# Altium project Science.PrjPcb
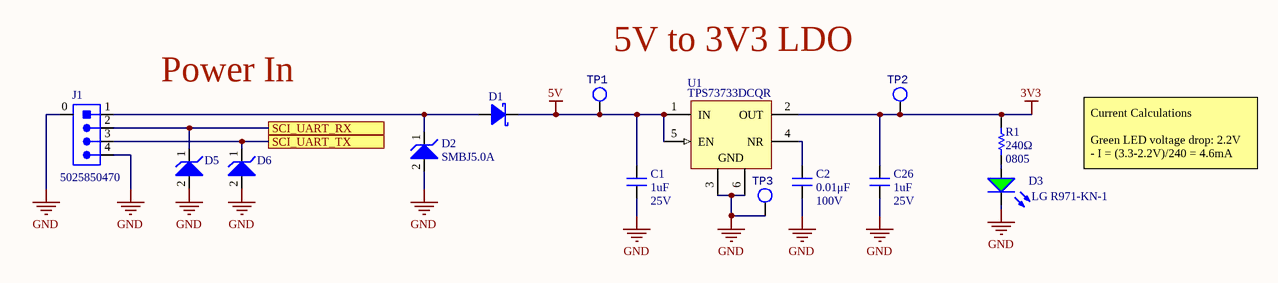
[diagram p0: SH1-POWER.SchDoc]
3 sheets, 91 parts. Net scope: flat (ports and power ports of the same name join across sheets).
Sheets:
  SH1-POWER.SchDoc
  SH2-MCU.SchDoc
  SH3-CONTROLS.SchDoc

## Sheet SH1-POWER.SchDoc: RC Science - Power
size Letter; DrawnBy: Christopher Arjune; SheetNumber: 1; SheetTotal: 3

### Parts
C1  Capacitance: 1uF  Voltage Rating (DC): 25V  [CAPC2012X140N]
C2  value 0.01μF  Voltage Rating: 100V  [CAP2012]  (hidden comment: CAP_0.01uF_100V_0805)
C26  Capacitance: 1uF  Voltage Rating (DC): 25V  [CAPC2012X140N]
D1  DIO_SCHOTTKY_30V_2A  [SOD-128]  (value not drawn)
D2  TVS_DIODE_UNIDIR_5V  [SMBJ5.0A]  (value not drawn)
D3  LG R971-KN-1  [LED_0805_LINE]
D5  TVS_DIODE_UNIDIR_3.3V  [SOD523]  (value not drawn)
D6  TVS_DIODE_UNIDIR_3.3V  [SOD523]  (value not drawn)
J1  Manufactor Number: 5025850470  [MOLEX-5025850470]  (hidden comment: CON_4M_SM_RA)
R1  Resistance: 240Ω  Case Code (Imperial): 0805  [RESC2012X60N]  (hidden comment: 240)
TP1  TESTPOINT_LOOP  [TESTPOINT_LOOP]  (value not drawn)
TP2  TESTPOINT_LOOP  [TESTPOINT_LOOP]  (value not drawn)
TP3  TESTPOINT_LOOP  [TESTPOINT_LOOP]  (value not drawn)
U1  TPS73733DCQR  [SOT-223-6]

### Ports
SCI_UART_RX, SCI_UART_TX

### Nets
3V3: C26.2 R1.2 TP2.1 U1.2(OUT)
5V: C1.1 D1.2(Cathode) TP1.1 U1.1(IN) U1.5(EN)
GND: C1.2 C2.1 C26.1 D2.2 D3.2(K) D5.2 D6.2 J1.0 J1.4 TP3.1 U1.3(GND) U1.6(GND)
NetC2_2: C2.2 U1.4(NR)
NetD1_1: D1.1(Anode) D2.1 J1.1
NetD3_1: D3.1(A) R1.1
NetD5_1: D5.1 J1.2 ; port SCI_UART_RX
NetD6_1: D6.1 J1.3 ; port SCI_UART_TX

### Notes on the sheet
- Power In
- 5V to 3V3 LDO
- Current Calculations
  Green LED voltage drop: 2.2V
  - I = (3.3-2.2V)/240 = 4.6mA
- Title
- Size:
- Date:
- Letter
- Drawn By:
- Sheet
- of
- File:

### Library data of the parts
C1 C26 = CAP_1uF_25V_0805: CAP CER 1UF 25V X7R 0805; Manufacturer 1: Murata; Manufacturer Part Number 1: GCM21BR71E105KA56K; Tolerance: 10%; Supplier 1: Digi-Key; Stock 1: 31473; Pricing 1: 1=0.34000, 10=0.23600, 100=0.13360, 500=0.09432, 1000=0.08254, 2500=0.07861, 5000=0.07271 (USD); RoHS: Yes; Mount: Surface Mount; Case/Package: 0805; Case Code (Metric): 2012; Case Code (Imperial): 0805; Min Operating Temperature: -55°C; Max Operating Temperature: 125°C; Package Quantity: 10000; Voltage Rating: 25V; Packaging: Tape and Reel; Dielectric: X7R; Termination: SMD/SMT; Length: 2mm; Height: 1.25mm; Width: 0.049inch; Thickness: 0.055inch; Depth: 1.25mm; Ratings: AEC-Q200; Radiation Hardening: No; ComponentLink1URL: https://datasheet.ciiva.com/169/product-169236.pdf?src-supplier=Digi-Key; ComponentLink1Description: https://datasheet.ciiva.com/169/product-169236.pdf?src-supplier=Digi-Key; ComponentLink2URL: https://datasheet.ciiva.com/11616/product-11616618.pdf?src-supplier=Avnet; ComponentLink2Description: https://datasheet.ciiva.com/11616/product-11616618.pdf?src-supplier=Avnet; Supplier Part Number 1: 490-14743-1-ND
C2 = CAP_0.01uF_100V_0805: CAP CER 10000PF 100V X7R 0805; Manufacturer 1: KEMET; Manufacturer Part Number 1: C0805C103K1RACTU; Tolerance: 10%; Mount: Surface Mount; Case Code (Metric): 2012; Case Code (Imperial): 0805; Min Operating Temperature: -55°C; Max Operating Temperature: 125°C; Termination: SMD/SMT; Supplier 1: Digi-Key; Supplier Part Number 1: 399-1159-1-ND; Package: 0805 (2012 Metric); Dielectric: X7R
D1 = DIO_SCHOTTKY_30V_2A: DIODE SCHOTTKY 30V 2A PMDTM; Manufacturer 1: Rohm Semiconductor; Manufacturer Part Number 1: RSX205LAM30TR; Vf (Max): 490mV; Supplier 1: Digi-Key; Supplier Part Number 1: RSX205LAM30CT-ND; Mount: Surface Mount; Vr (Max): 30V; Io: 2A
D2 = TVS_DIODE_UNIDIR_5V: TVS DIODE 5V 9.2V DO214AA; Manufacturer 1: Bourns; Operating Supply Voltage: 3.5V; Max Surge Current: 100A; Reverse Breakdown Voltage: 6.4V; Peak Pulse Power: 600W; Power Line Protection: No; Breakdown Voltage: 7.25V; Number of Channels: 1; Polarity: Unidirectional; Max Reverse Leakage Current: 800uA; Test Current: 10mA; Peak Pulse Current: 65.2A; Supplier 1: Digi-Key; Mount: Surface Mount; Number of Pins: 2; Min Operating Temperature: -55°C; Max Operating Temperature: 150°C; Reverse Standoff Voltage: 5V; Clamping Voltage: 9.2V; Max Power Dissipation: 600W; Max Breakdown Voltage: 7.25V; Leakage Current: 800uA; Composition: Zener; Supplier Part Number 1: SMBJ5.0ABCT-ND; Zener Voltage: *; Min Breakdown Voltage: 6.4V; Manufacturer Part Number 1: SMBJ5.0A
D3 = DIO_LED_G: LED GREEN DIFFUSED 0805 SMD; Manufacturer 1: OSRAM; Forward Voltage Drop: 2.2V; Package: 0805 (2012 Metric); Manufacturer Part Number 1: LG R971-KN-1; Supplier Part Number 1: 475-1410-1-ND; Supplier 1: Digi-Key; Mount: Surface Mount
D5 D6 = TVS_DIODE_UNIDIR_3.3V: TVS DIODE 3.3V 14.1V SOD523. Used to protect each connector input line going into the MCU.; Manufacturer 1: ON Semiconductor; Manufacturer Part Number 1: ESD5Z3.3T1G; Reverse Breakdown Voltage: 5V; Peak Pulse Power: 158W; Power Line Protection: No; Number of Channels: 1; Polarity: Unidirectional; Peak Pulse Current: 11.2A; Supplier 1: Digi-Key; Mount: Surface Mount; Number of Pins: 2; Min Operating Temperature: -55°C; Max Operating Temperature: 150°C; Reverse Standoff Voltage: 3.3V; Clamping Voltage: 14.1V; Composition: Zener; Supplier Part Number 1: ESD5Z3.3T1GOSCT-ND
J1 = CON_4M_SM_RA: CONN HEADER SMD RIGHT ANGLE 1.5 MM PITCH; Manufacturer: Molex; Supplier 1: Digi-Key; Supplier Part Number 1: WM9449CT-ND
R1 = RES_120Ω_0805_1%: RES 240 OHM 1% 1/8W 0805; Manufacturer 1: Vishay; Manufacturer Part Number 1: CRCW0805240RFKEA; Temperature Coefficient: 100ppm/°C; Max Power Dissipation: 125mW; Voltage Rating (DC): 150V; Supplier 1: Digi-Key; Stock 1: 27214; Pricing 1: 1=0.10000, 10=0.05700, 100=0.02310, 1000=0.01039, 2500=0.00902 (USD); RoHS: Yes; Case/Package: 0805; Case Code (Metric): 2012; Contact Plating: Tin; Weight: 0.000194oz; Min Operating Temperature: -55°C; Max Operating Temperature: 155°C; Tolerance: 1%; Packaging: Tape and Reel; Package Quantity: 10; Resistor Type: Thick Film; Number of Terminations: 2; Features: Automotive AEC-Q200; Power Rating: 125mW; Voltage Rating: 150V; Termination: SMD/SMT; Length: 2mm; Width: 0.049inch; Height: 0.45mm; Depth: 1.25mm; Radiation Hardening: No; Lead Free: Lead Free; REACH SVHC: Unknown; Military Standard: Not; ComponentLink1URL: https://datasheet.ciiva.com/11810/0900766b80d98b26-11810664.pdf?src-supplier=RSComponents; ComponentLink1Description: https://datasheet.ciiva.com/11810/0900766b80d98b26-11810664.pdf?src-supplier=RSComponents; ComponentLink2URL: https://datasheet.ciiva.com/2467/dcrcwe3-2467397.pdf?src-supplier=Digi-Key; ComponentLink2Description: https://datasheet.ciiva.com/2467/dcrcwe3-2467397.pdf?src-supplier=Digi-Key; ComponentLink3URL: https://datasheet.ciiva.com/5541/dcrcwe3-109170-5541461.pdf?src-supplier=Mouser; ComponentLink3Description: https://datasheet.ciiva.com/5541/dcrcwe3-109170-5541461.pdf?src-supplier=Mouser; ComponentLink4URL: https://datasheet.ciiva.com/2467/dcrcwe3-2467395.pdf?src-supplier=Digi-Key; ComponentLink4Description: https://datasheet.ciiva.com/2467/dcrcwe3-2467395.pdf?src-supplier=Digi-Key; ComponentLink5URL: https://datasheet.ciiva.com/2467/dcrcwe3-2467396.pdf?src-supplier=Digi-Key; ComponentLink5Description: https://datasheet.ciiva.com/2467/dcrcwe3-2467396.pdf?src-supplier=Digi-Key; ComponentLink6URL: https://datasheet.ciiva.com/15159/getdatasheetpartid-101887-15159995.pdf?src-supplier=Verical; ComponentLink6Description: https://datasheet.ciiva.com/15159/getdatasheetpartid-101887-15159995.pdf?src-supplier=Verical; ComponentLink7URL: https://datasheet.ciiva.com/16435/dcrcwe3-16435931.pdf?src-supplier=Future+Electronics; ComponentLink7Description: https://datasheet.ciiva.com/16435/dcrcwe3-16435931.pdf?src-supplier=Future+Electronics; ComponentLink8URL: https://datasheet.ciiva.com/26317/fld-crcw-e3-data-en-26317341.pdf?src-supplier=Distrelec; ComponentLink8Description: https://datasheet.ciiva.com/26317/fld-crcw-e3-data-en-26317341.pdf?src-supplier=Distrelec; Supplier Part Number 1: 541-240CCT-ND
TP1-TP3 = TESTPOINT_LOOP: Loop testpoint through-hole pad; Manufacturer 1: Keystone Electronics; Manufacturer Part Number 1: 5002; Supplier Part Number 1: 36-5002-ND; Supplier 1: Digi-Key; Mount: Through Hole
U1 = CMP-0395-00300-2: IC REG LINEAR 3.3V 1A SOT223-6; Manufacturer: Texas Instruments; Fixed Output Options(V): 3.3; Vdo(Typ)(mV): 130; Iout(Max)(A): 1; Accuracy(%): 3; SubFamily: Single Channel LDO; Eco-Plan: Green (RoHS & no Sb/Br); Vin(Min)(V): 2.2; Vin(Max)(V): 5.5; Rating: Catalog; Iq(Typ)(mA): 0.3; PartNumber: TPS73733DCQR; DatasheetVersion: SBVS067O; PackageReference: DCQ0006A; PackageDescription: 6-Pin Plastic Small Outline, Body 3.5 x 6.5 mm, Pitch 1.27 mm; PackageVersion: 4202109/D; Vout Adj(Min)(V): 3.3; Vout Adj(Max)(V): 3.3; Mounting Technology: Surface Mount; Supplier 1: Digi-Key; Supplier Part Number 1: 296-22681-2-ND; Manufacturer 1: Texas Instruments; Manufacturer Part Number 1: TPS73733DCQR

## Sheet SH2-MCU.SchDoc: RC Science - Microcontroller
size Letter; DrawnBy: Christopher Arjune; SheetNumber: 2; SheetTotal: 3
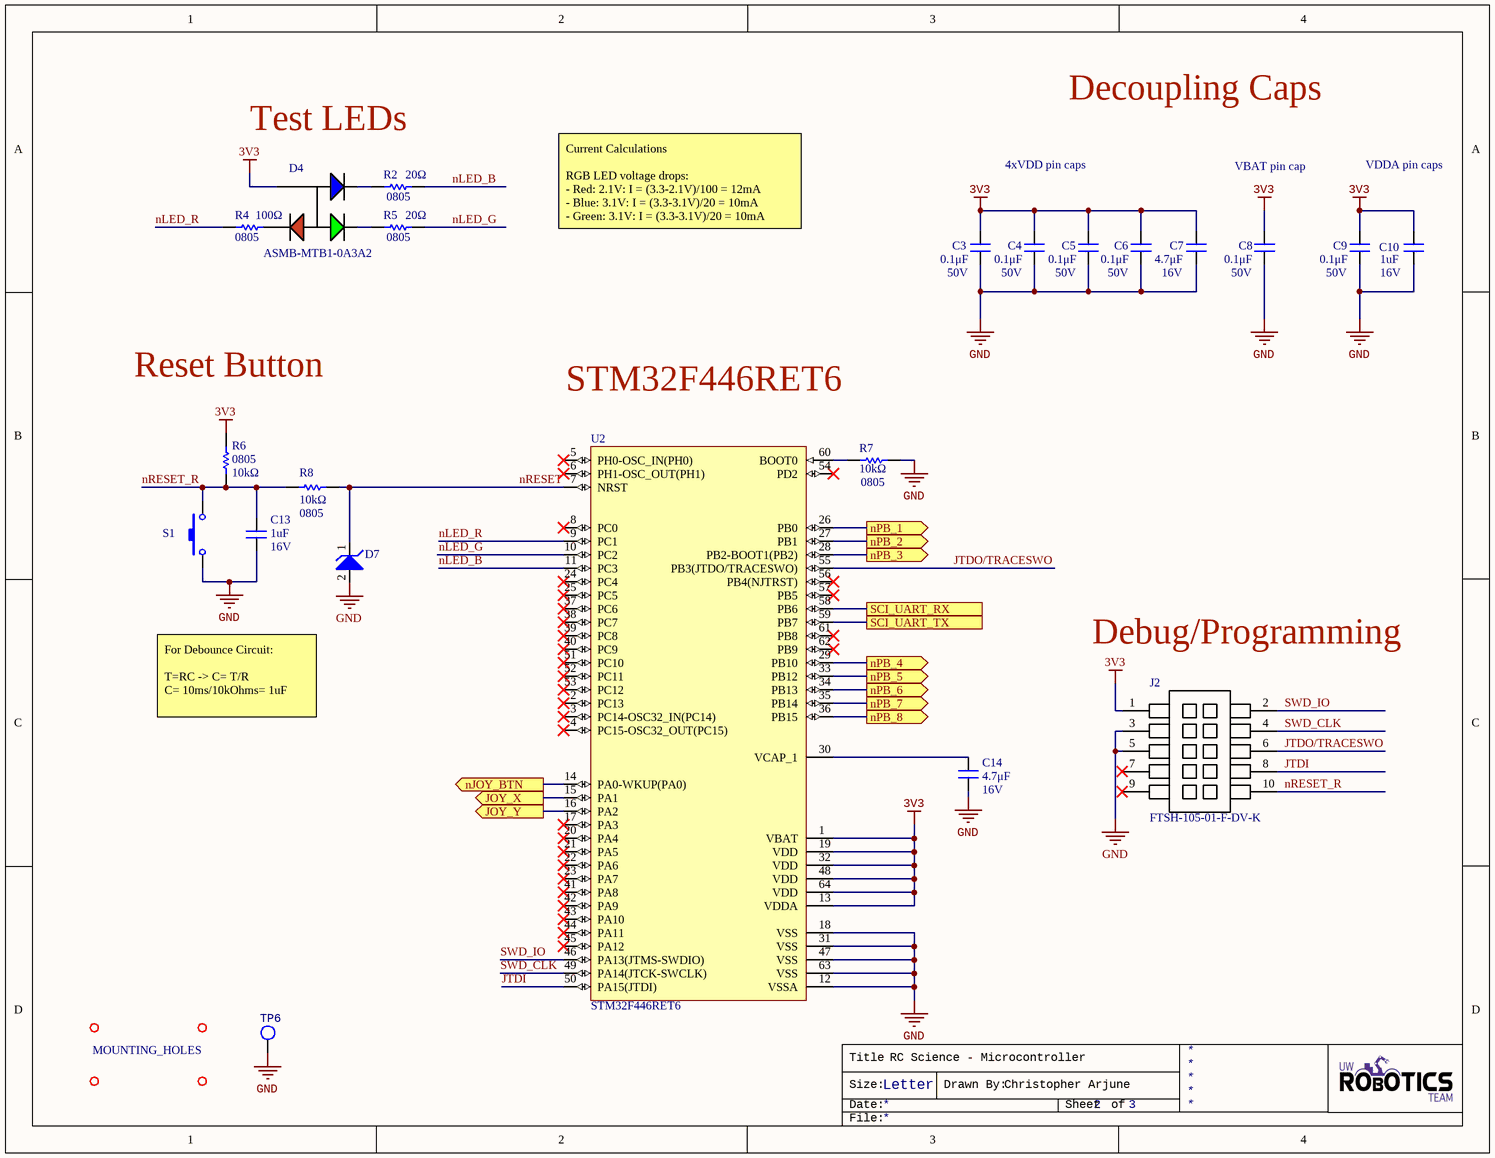
[diagram p1: SH2-MCU.SchDoc]

### Parts
C3  Voltage Rating: 50V  [CAPC2012X140N]  (hidden comment: 0.1μF)
C4  Voltage Rating: 50V  [CAPC2012X140N]  (hidden comment: 0.1μF)
C5  Voltage Rating: 50V  [CAPC2012X140N]  (hidden comment: 0.1μF)
C6  Voltage Rating: 50V  [CAPC2012X140N]  (hidden comment: 0.1μF)
C7  value 4.7μF  Voltage Rating: 16V  [CAPC2012X140N]  (hidden comment: CAP_4.7uF_16V_0805)
C8  Voltage Rating: 50V  [CAPC2012X140N]  (hidden comment: 0.1μF)
C9  Voltage Rating: 50V  [CAPC2012X140N]  (hidden comment: 0.1μF)
C10  value 1uF  Voltage Rating: 16V  [CAPC2012X140N]  (hidden comment: CAP_1uF_16V_0805)
C13  value 1uF  Voltage Rating: 16V  [CAPC2012X140N]  (hidden comment: CAP_1uF_16V_0805)
C14  value 4.7μF  Voltage Rating: 16V  [CAPC2012X140N]  (hidden comment: CAP_4.7uF_16V_0805)
D4  Manufacturer Part Number 1: ASMB-MTB1-0A3A2  [LED_RGB]  (hidden comment: LED_RGB)
D7  TVS_DIODE_UNIDIR_3.3V  [SOD523]  (value not drawn)
J2  Manufacturer Part Number 1: FTSH-105-01-F-DV-K  [FTSH-105-01-F-DV-K-P-TR]  (hidden comment: CON_PROGRAMMING)
MH1  MOUNTING_HOLES  [MOUNTING_HOLE]  (value not drawn)
MH2  MOUNTING_HOLES  [MOUNTING_HOLE]  (value not drawn)
MH3  MOUNTING_HOLES  [MOUNTING_HOLE]
MH4  MOUNTING_HOLES  [MOUNTING_HOLE]  (value not drawn)
R2  value 20Ω  Case Code (Imperial): 0805  [RESC2012X60N]  (hidden comment: RES_20Ω_0805)
R4  value 100Ω  Case Code (Imperial): 0805  [RESC2012X60N]  (hidden comment: RES_100Ω_0805)
R5  value 20Ω  Case Code (Imperial): 0805  [RESC2012X60N]  (hidden comment: RES_20Ω_0805)
R6  value 10kΩ  Case Code (Imperial): 0805  [RESC2012X60N]  (hidden comment: RES_10kΩ_0805)
R7  value 10kΩ  Case Code (Imperial): 0805  [RESC2012X60N]  (hidden comment: RES_10kΩ_0805)
R8  value 10kΩ  Case Code (Imperial): 0805  [RESC2012X60N]  (hidden comment: RES_10kΩ_0805)
S1  SW_TACTILE  [B3U-1000P]  (value not drawn)
TP6  TESTPOINT_LOOP  [TESTPOINT_LOOP]  (value not drawn)
U2  STM32F446RET6  [STM-LQFP64_L]

### Ports
JOY_X (out), JOY_Y (out), nJOY_BTN (out), nPB_1 (out), nPB_2 (out), nPB_3 (out), nPB_4 (out), nPB_5 (out), nPB_6 (out), nPB_7 (out), nPB_8 (out), SCI_UART_RX, SCI_UART_TX

### Nets
3V3: C3.2 C4.2 C5.2 C6.2 C7.2 C8.2 C9.2 C10.2 D4.4 J2.1 R6.2 U2.1(VBAT) U2.13(VDDA) U2.19(VDD) U2.32(VDD) U2.48(VDD) U2.64(VDD)
GND: C3.1 C4.1 C5.1 C6.1 C7.1 C8.1 C9.1 C10.1 C13.1 C14.1 D7.2 J2.3 J2.5 R7.2 S1.2 TP6.1 U2.12(VSSA) U2.18(VSS) U2.31(VSS) U2.47(VSS) U2.63(VSS)
JTDI: J2.8 U2.50(PA15(JTDI))
JTDO/TRACESWO: J2.6 U2.55(PB3(JTDO/TRACESWO))
nLED_B: R2.2 U2.11(PC3)
nLED_G: R5.2 U2.10(PC2)
nLED_R: R4.1 U2.9(PC1)
nRESET: D7.1 R8.2 U2.7(NRST)
nRESET_R: C13.2 J2.10 R6.1 R8.1 S1.1
SWD_CLK: J2.4 U2.49(PA14(JTCK-SWCLK))
SWD_IO: J2.2 U2.46(PA13(JTMS-SWDIO))
NetC11_2: U2.26(PB0) ; port nPB_1
NetC12_2: U2.33(PB12) ; port nPB_5
NetC14_2: C14.2 U2.30(VCAP_1)
NetC15_2: U2.14(PA0-WKUP(PA0)) ; port nJOY_BTN
NetC16_2: U2.15(PA1) ; port JOY_X
NetC17_2: U2.16(PA2) ; port JOY_Y
NetC18_2: U2.27(PB1) ; port nPB_2
NetC19_2: U2.34(PB13) ; port nPB_6
NetC20_2: U2.28(PB2-BOOT1(PB2)) ; port nPB_3
NetC21_2: U2.35(PB14) ; port nPB_7
NetC22_2: U2.29(PB10) ; port nPB_4
NetC23_2: U2.36(PB15) ; port nPB_8
NetD4_1: D4.1 R4.2
NetD4_2: D4.2 R5.1
NetD4_3: D4.3 R2.1
NetD5_1: U2.58(PB6) ; port SCI_UART_RX
NetD6_1: U2.59(PB7) ; port SCI_UART_TX
NetR7_1: R7.1 U2.60(BOOT0)

Not connected (* = marked no-connect by the designer): J2 7* 9*; U2 2(PC13)* 3(PC14-OSC32_IN(PC14))* 4(PC15-OSC32_OUT(PC15))* 5(PH0-OSC_IN(PH0))* 6(PH1-OSC_OUT(PH1))* 8(PC0)* 17(PA3)* 20(PA4)* 21(PA5)* 22(PA6)* 23(PA7)* 24(PC4)* 25(PC5)* 37(PC6)* 38(PC7)* 39(PC8)* 40(PC9)* 41(PA8)* 42(PA9)* 43(PA10)* 44(PA11)* 45(PA12)* 51(PC10)* 52(PC11)* 53(PC12)* 54(PD2)* 56(PB4(NJTRST))* 57(PB5)* 61(PB8)* 62(PB9)*

### Notes on the sheet
- Test LEDs
- 4xVDD pin caps
- Decoupling Caps
- VDDA pin caps
- Current Calculations
  RGB LED voltage drops:
  - Red: 2.1V: I = (3.3-2.1V)/100 = 12mA
  - Blue: 3.1V: I = (3.3-3.1V)/20 = 10mA
  - Green: 3.1V: I = (3.3-3.1V)/20 = 10mA
- VBAT pin cap
- Reset Button
- STM32F446RET6
- Debug/Programming
- For Debounce Circuit:
  T=RC -> C= T/R
  C= 10ms/10kOhms= 1uF
- Title
- Size:
- Date:
- Letter
- Drawn By:
- Sheet
- of
- File:

### Library data of the parts
C3-C6 C8 C9 = CAP_0.1uF_50V_0805: CAP CER 0.1UF 50V X7R 0805; Manufacturer 1: Murata Electronics; Manufacturer Part Number 1: GCD21BR71H104KA01L; Tolerance: 10%; Mount: Surface Mount; Case Code (Metric): 2012; Case Code (Imperial): 0805; Min Operating Temperature: -55°C; Max Operating Temperature: 125°C; Dielectric: X7R; Termination: SMD/SMT; Length: 2mm; Height: 1.25mm; Width: 0.049inch; Thickness: 0.049inch; Depth: 1.25mm; Ratings: AEC-Q200; ComponentLink1URL: https://datasheet.ciiva.com/29537/c03e-29537701.pdf?src-supplier=Digi-Key; ComponentLink1Description: https://datasheet.ciiva.com/29537/c03e-29537701.pdf?src-supplier=Digi-Key; Supplier 1: Digi-Key; Supplier Part Number 1: 490-11955-1-ND; Value: 0.1μF; Package: 0805 (2012 Metric)
C7 C14 = CAP_4.7uF_16V_0805: CAP CER 4.7UF 16V X5R 0805; Manufacturer 1: Samsung Electro-Mechanics; Manufacturer Part Number 1: CL21A475KOFNNNE; Tolerance: 10%; Mount: Surface Mount; Case Code (Metric): 2012; Case Code (Imperial): 0805; Min Operating Temperature: -55°C; Max Operating Temperature: 85°C; Dielectric: X5R; Termination: SMD/SMT; Supplier 1: Digi-Key; Supplier Part Number 1: 1276-1065-1-ND; Package: 0805 (2012 Metric)
C10 C13 = CAP_1uF_16V_0805: CAP CER 1UF 16V X7R 0805; Manufacturer 1: Yageo; Manufacturer Part Number 1: CC0805KKX7R7BB105; Tolerance: 10%; Mount: Surface Mount; Case Code (Metric): 2012; Case Code (Imperial): 0805; Min Operating Temperature: -55°C; Max Operating Temperature: 125°C; Dielectric: X7R; Termination: SMD/SMT; Supplier 1: Digi-Key; Supplier Part Number 1: 311-1365-1-ND; Package: 0805 (2012 Metric)
D4 = LED_RGB: LED RGB DIFFUSED 4PLCC SMD; Manufacturer 1: Broadcom; Color: Blue,Green,Red; Lens Color: White; Viewing Angle: 115°; Lens Style: Round; Luminous Intensity: 350mcd; Dominant Wavelength: 470nm; Forward Voltage: 3.1V; Test Current: 20mA; Supplier 1: Digi-Key; Stock 1: 142531; Pricing 1: 1=0.60000, 10=0.47100, 100=0.30210, 500=0.25980, 1000=0.20059 (USD); RoHS: Yes; Mount: Surface Mount; Case/Package: PLCC; Number of Pins: 4; Packaging: Cut Tape; Lens Transparency: Diffused; Length: 3.2mm; Height: 1.9mm; Width: 2.8mm; REACH SVHC: No SVHC; ComponentLink1URL: http://www.farnell.com/datasheets/2111106.pdf?src-supplier=Farnell; ComponentLink1Description: http://www.farnell.com/datasheets/2111106.pdf?src-supplier=Farnell; ComponentLink2URL: https://docs.broadcom.com/docs/AV02-4194EN?src-supplier=Digi-Key; ComponentLink2Description: https://docs.broadcom.com/docs/AV02-4194EN?src-supplier=Digi-Key; ComponentLink3URL: http://www.farnell.com/datasheets/1801564.pdf?src-supplier=Element14; ComponentLink3Description: http://www.farnell.com/datasheets/1801564.pdf?src-supplier=Element14; ComponentLink4URL: http://www.farnell.com/datasheets/2111106.pdf?src-supplier=Newark; ComponentLink4Description: http://www.farnell.com/datasheets/2111106.pdf?src-supplier=Newark; Supplier Part Number 1: 516-3280-1-ND
D7 = TVS_DIODE_UNIDIR_3.3V: as D5 on sheet SH1-POWER; Supplier 1: Digi-Key; Mount: Surface Mount; Number of Pins: 2; Min Operating Temperature: -55°C; Max Operating Temperature: 150°C; Reverse Standoff Voltage: 3.3V; Clamping Voltage: 14.1V; Composition: Zener; Supplier Part Number 1: ESD5Z3.3T1GOSCT-ND
J2 = CON_PROGRAMMING: Board Connector, 10 Contact(s), 2 Row(s), Male, Straight, 0.05 inch Pitch, Surface Mount Terminal, Locking; Manufacturer 1: Samtec; Number of Contacts: 10; Connector Type: Male Pin; Max Current Rating: 1.75A; Pitch: 1.27mm; Supplier 1: Digi-Key; RoHS: Yes; Category: Headers and Wire Housings; Stock 1: 19926; Pricing 1: 1=2.90000, 10=2.78400, 100=2.32000, 500=1.97200, 1000=1.68200, 5000=1.50800 (USD); Mount: Surface Mount; Contact Plating: Gold; Contact Material: Copper,Bronze; Housing Color: Black; Housing Material: Polymer; Color: Black; Min Operating Temperature: -55°C; Max Operating Temperature: 125°C; Number of Rows: 2; Termination: Solder; Packaging: Rail/Tube; Orientation: Straight; Package Quantity: 1; Number of Positions: 10; Length: 15.2mm; Height: 3.3mm; Depth: 3.43mm; Row Spacing: 0.05inch; Contact Mating Length: 0.12inch; Radiation Hardening: No; Lead Free: Lead Free; ComponentLink1URL: https://datasheet.ciiva.com:443/pdfs/VipMasterIC/IC/SAMI/SAMI-S-A0003531380/SAMI-S-A0003531380-1.pdf?src-supplier=IHS+Markit; ComponentLink1Description: https://datasheet.ciiva.com:443/pdfs/VipMasterIC/IC/SAMI/SAMI-S-A0003531380/SAMI-S-A0003531380-1.pdf?src-supplier=IHS+Markit; ComponentLink2URL: https://datasheet.ciiva.com/19461/2046846-19461026.pdf?src-supplier=Jameco; ComponentLink2Description: https://datasheet.ciiva.com/19461/2046846-19461026.pdf?src-supplier=Jameco; ComponentLink3URL: https://datasheet.ciiva.com/16657/ftsh-mt-16657371.pdf?src-supplier=Avnet+Europe; ComponentLink3Description: https://datasheet.ciiva.com/16657/ftsh-mt-16657371.pdf?src-supplier=Avnet+Europe; ComponentLink4URL: https://datasheet.ciiva.com/15195/getdatasheetpartid-133463-15195260.pdf?src-supplier=Verical; ComponentLink4Description: https://datasheet.ciiva.com/15195/getdatasheetpartid-133463-15195260.pdf?src-supplier=Verical; ComponentLink5URL: https://datasheet.ciiva.com/738/ftsh-1xx-xx-xxx-dv-xxx-mkt-738998.pdf?src-supplier=Digi-Key; ComponentLink5Description: https://datasheet.ciiva.com/738/ftsh-1xx-xx-xxx-dv-xxx-mkt-738998.pdf?src-supplier=Digi-Key; ComponentLink6URL: https://datasheet.ciiva.com/10245/ftsh-mt-10245273.pdf?src-supplier=Avnet; ComponentLink6Description: https://datasheet.ciiva.com/10245/ftsh-mt-10245273.pdf?src-supplier=Avnet; Supplier Part Number 1: SAM8796-ND
MH1-MH4 = MOUNTING_HOLES: 6cm x 6cm
R2 R5 = RES_20Ω_0805: RES SMD 20 OHM 1% 1/8W 0805; Manufacturer 1: Yageo; Manufacturer Part Number 1: RC0805FR-0720RL; Resistance: 20; Power Rating: 125mW; Supplier 1: Digi-Key; Case Code (Metric): 2012; Min Operating Temperature: -55°C; Max Operating Temperature: 155°C; Tolerance: 1%; Termination: SMD/SMT; Supplier Part Number 1: 311-20.0CRCT-ND; Package: 0805 (2012 Metric)
R4 = RES_100Ω_0805: RES SMD 100 OHM 1% 1/8W 0805; Manufacturer 1: Yageo; Manufacturer Part Number 1: RC0805FR-07100RL; Power Rating: 125mW; Supplier 1: Digi-Key; Mount: Surface Mount; Case Code (Metric): 2012; Supplier Part Number 1: 311-100CRCT-ND; Package: 0805 (2012 Metric)
R6-R8 = RES_10kΩ_0805: RES SMD 10K OHM 1% 1/8W 0805; Manufacturer 1: Yageo; Manufacturer Part Number 1: RC0805FR-0710KL; Power Rating: 125mW; Supplier 1: Digi-Key; Case Code (Metric): 2012; Min Operating Temperature: -55°C; Max Operating Temperature: 155°C; Resistance: 10K; Tolerance: 1%; Termination: SMD/SMT; Supplier Part Number 1: 311-10.0KCRCT-ND; Package: 0805 (2012 Metric)
S1 = SW_TACTILE: Tactile Switch (Grey); Manufacturer 1: Omron Electronics Inc-EMC Div; Manufacturer Part Number 1: B3U-1000P; Supplier 1: Digi-Key; Supplier Part Number 1: SW1020CT-ND; Mount: Surface Mount
TP6 = TESTPOINT_LOOP: Loop testpoint through-hole pad; Manufacturer Part Number 1: 5002; Manufacturer 1: Keystone Electronics; Supplier Part Number 1: 36-5002-ND; Supplier 1: Digi-Key; Mount: Through Hole
U2 = MCU_STM32F446RET6: ARM Cortex-M4 32-bit MCU+FPU, 512 KB Flash, 128 KB Internal RAM, 50 I/Os, 64-Pin LQFP, -40 to 85 degC, Tray; I/Os (High Current): 50; Supply Voltage(Vcc) min (V): 1.7; Operating Frequency(F) (Processor speed) (MHz): 180; D/A Converter: 2; Internal RAM Size (kB): 128; FLASH Size (Prog) (kB): 512; Core: ARM Cortex-M4; ComponentLink1Description: Manufacturer URL; Package Reference: 64-Pin Low-profile Quad Flat Package, Body 10 x 10 mm, Pitch 0.5 mm; ComponentLink2URL: http://www.st.com/st-web-ui/static/active/en/resource/technical/document/datasheet/DM00141306.pdf; Packing: Tray; DatasheetVersion: Rev. 6; ComponentLink1URL: http://www.st.com/; ComponentLink2Description: Datasheet; Package Description: LQFP64; Mounting Technology: Surface Mount; Supplier Part Number 1: 497-15376-ND; Supplier 1: Digi-Key

## Sheet SH3-CONTROLS.SchDoc: RC Science - Controls
size Letter; DrawnBy: Christopher Arjune; SheetNumber: 3; SheetTotal: 3
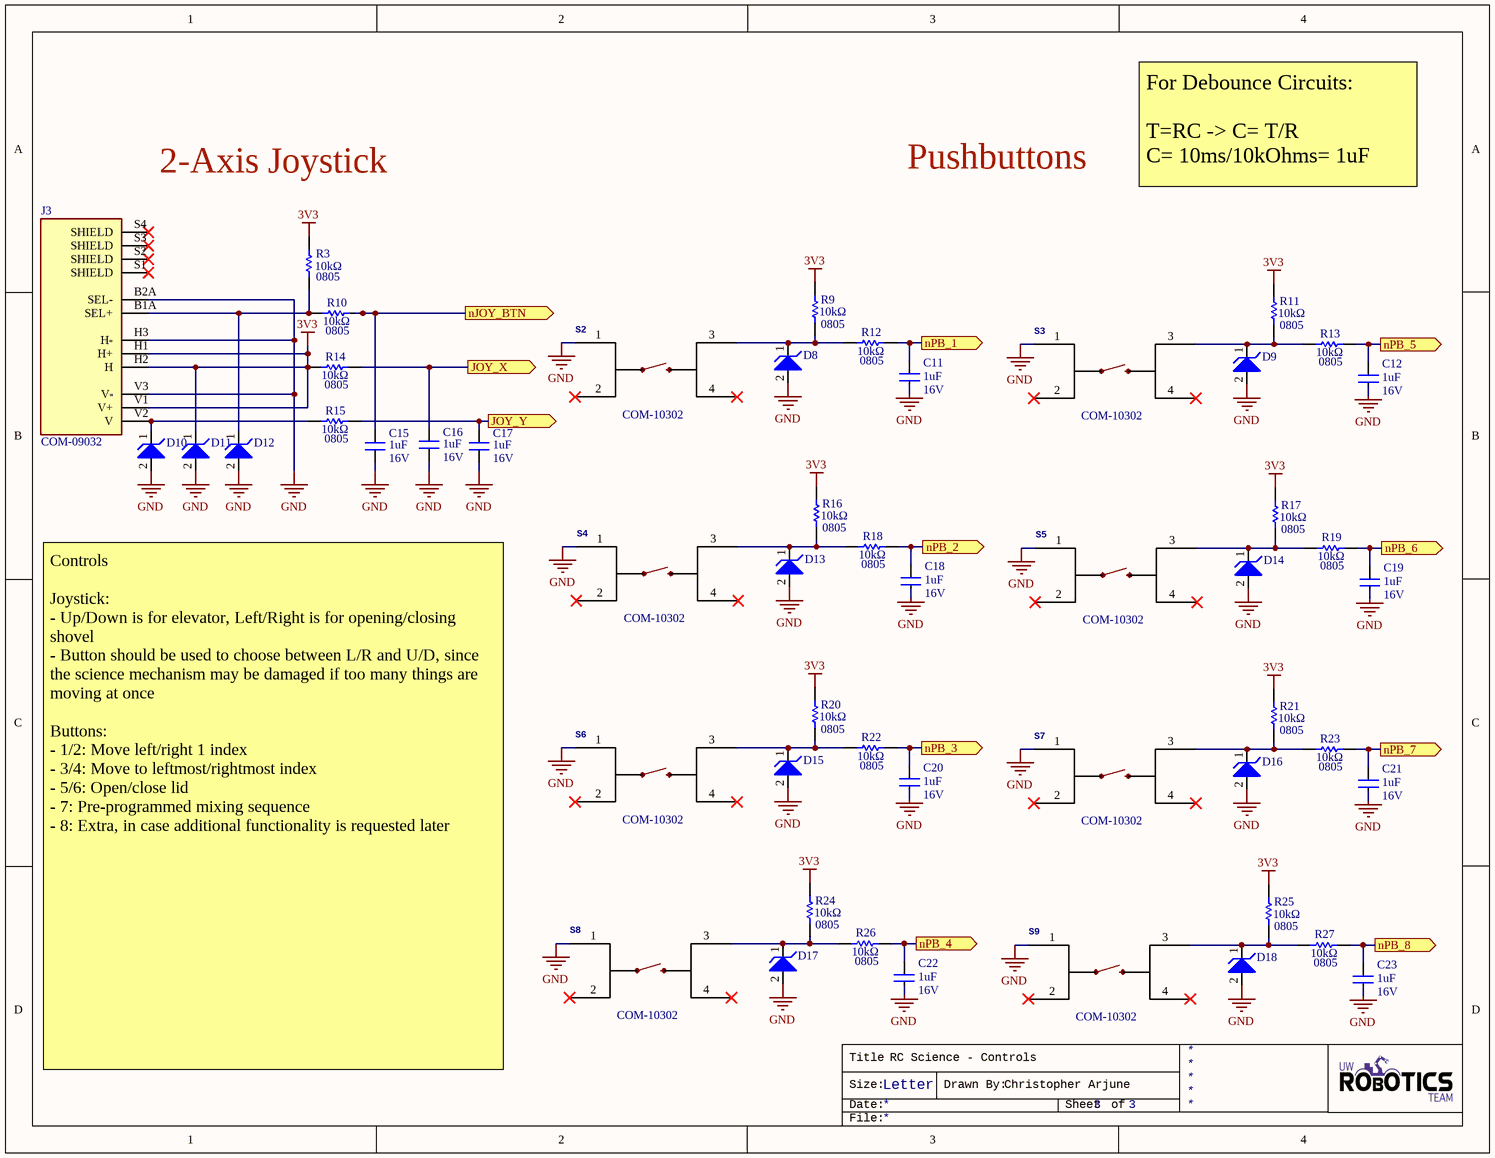
[diagram p2: SH3-CONTROLS.SchDoc]

### Parts
C11  value 1uF  Voltage Rating: 16V  [CAPC2012X140N]  (hidden comment: CAP_1uF_16V_0805)
C12  value 1uF  Voltage Rating: 16V  [CAPC2012X140N]  (hidden comment: CAP_1uF_16V_0805)
C15  value 1uF  Voltage Rating: 16V  [CAPC2012X140N]  (hidden comment: CAP_1uF_16V_0805)
C16  value 1uF  Voltage Rating: 16V  [CAPC2012X140N]  (hidden comment: CAP_1uF_16V_0805)
C17  value 1uF  Voltage Rating: 16V  [CAPC2012X140N]  (hidden comment: CAP_1uF_16V_0805)
C18  value 1uF  Voltage Rating: 16V  [CAPC2012X140N]  (hidden comment: CAP_1uF_16V_0805)
C19  value 1uF  Voltage Rating: 16V  [CAPC2012X140N]  (hidden comment: CAP_1uF_16V_0805)
C20  value 1uF  Voltage Rating: 16V  [CAPC2012X140N]  (hidden comment: CAP_1uF_16V_0805)
C21  value 1uF  Voltage Rating: 16V  [CAPC2012X140N]  (hidden comment: CAP_1uF_16V_0805)
C22  value 1uF  Voltage Rating: 16V  [CAPC2012X140N]  (hidden comment: CAP_1uF_16V_0805)
C23  value 1uF  Voltage Rating: 16V  [CAPC2012X140N]  (hidden comment: CAP_1uF_16V_0805)
D8  TVS_DIODE_UNIDIR_3.3V  [SOD523]  (value not drawn)
D9  TVS_DIODE_UNIDIR_3.3V  [SOD523]  (value not drawn)
D10  TVS_DIODE_UNIDIR_3.3V  [SOD523]  (value not drawn)
D11  TVS_DIODE_UNIDIR_3.3V  [SOD523]  (value not drawn)
D12  TVS_DIODE_UNIDIR_3.3V  [SOD523]  (value not drawn)
D13  TVS_DIODE_UNIDIR_3.3V  [SOD523]  (value not drawn)
D14  TVS_DIODE_UNIDIR_3.3V  [SOD523]  (value not drawn)
D15  TVS_DIODE_UNIDIR_3.3V  [SOD523]  (value not drawn)
D16  TVS_DIODE_UNIDIR_3.3V  [SOD523]  (value not drawn)
D17  TVS_DIODE_UNIDIR_3.3V  [SOD523]  (value not drawn)
D18  TVS_DIODE_UNIDIR_3.3V  [SOD523]  (value not drawn)
J3  Manufacturer Part Number 1: COM-09032  [2_AXIS_JOY]  (hidden comment: 2_AXIS_JOYSTICK)
R3  value 10kΩ  Case Code (Imperial): 0805  [RESC2012X60N]  (hidden comment: RES_10kΩ_0805)
R9  value 10kΩ  Case Code (Imperial): 0805  [RESC2012X60N]  (hidden comment: RES_10kΩ_0805)
R10  value 10kΩ  Case Code (Imperial): 0805  [RESC2012X60N]  (hidden comment: RES_10kΩ_0805)
R11  value 10kΩ  Case Code (Imperial): 0805  [RESC2012X60N]  (hidden comment: RES_10kΩ_0805)
R12  value 10kΩ  Case Code (Imperial): 0805  [RESC2012X60N]  (hidden comment: RES_10kΩ_0805)
R13  value 10kΩ  Case Code (Imperial): 0805  [RESC2012X60N]  (hidden comment: RES_10kΩ_0805)
R14  value 10kΩ  Case Code (Imperial): 0805  [RESC2012X60N]  (hidden comment: RES_10kΩ_0805)
R15  value 10kΩ  Case Code (Imperial): 0805  [RESC2012X60N]  (hidden comment: RES_10kΩ_0805)
R16  value 10kΩ  Case Code (Imperial): 0805  [RESC2012X60N]  (hidden comment: RES_10kΩ_0805)
R17  value 10kΩ  Case Code (Imperial): 0805  [RESC2012X60N]  (hidden comment: RES_10kΩ_0805)
R18  value 10kΩ  Case Code (Imperial): 0805  [RESC2012X60N]  (hidden comment: RES_10kΩ_0805)
R19  value 10kΩ  Case Code (Imperial): 0805  [RESC2012X60N]  (hidden comment: RES_10kΩ_0805)
R20  value 10kΩ  Case Code (Imperial): 0805  [RESC2012X60N]  (hidden comment: RES_10kΩ_0805)
R21  value 10kΩ  Case Code (Imperial): 0805  [RESC2012X60N]  (hidden comment: RES_10kΩ_0805)
R22  value 10kΩ  Case Code (Imperial): 0805  [RESC2012X60N]  (hidden comment: RES_10kΩ_0805)
R23  value 10kΩ  Case Code (Imperial): 0805  [RESC2012X60N]  (hidden comment: RES_10kΩ_0805)
R24  value 10kΩ  Case Code (Imperial): 0805  [RESC2012X60N]  (hidden comment: RES_10kΩ_0805)
R25  value 10kΩ  Case Code (Imperial): 0805  [RESC2012X60N]  (hidden comment: RES_10kΩ_0805)
R26  value 10kΩ  Case Code (Imperial): 0805  [RESC2012X60N]  (hidden comment: RES_10kΩ_0805)
R27  value 10kΩ  Case Code (Imperial): 0805  [RESC2012X60N]  (hidden comment: RES_10kΩ_0805)
S2  Manufacturer Part Number 1: COM-10302  [TACTILE_SWITCH_PTH_12MM]  (hidden comment: Pushbutton)
S3  Manufacturer Part Number 1: COM-10302  [TACTILE_SWITCH_PTH_12MM]  (hidden comment: Pushbutton)
S4  Manufacturer Part Number 1: COM-10302  [TACTILE_SWITCH_PTH_12MM]  (hidden comment: Pushbutton)
S5  Manufacturer Part Number 1: COM-10302  [TACTILE_SWITCH_PTH_12MM]  (hidden comment: Pushbutton)
S6  Manufacturer Part Number 1: COM-10302  [TACTILE_SWITCH_PTH_12MM]  (hidden comment: Pushbutton)
S7  Manufacturer Part Number 1: COM-10302  [TACTILE_SWITCH_PTH_12MM]  (hidden comment: Pushbutton)
S8  Manufacturer Part Number 1: COM-10302  [TACTILE_SWITCH_PTH_12MM]  (hidden comment: Pushbutton)
S9  Manufacturer Part Number 1: COM-10302  [TACTILE_SWITCH_PTH_12MM]  (hidden comment: Pushbutton)

### Ports
JOY_X (out), JOY_Y (out), nJOY_BTN (out), nPB_1 (out), nPB_2 (out), nPB_3 (out), nPB_4 (out), nPB_5 (out), nPB_6 (out), nPB_7 (out), nPB_8 (out)

### Nets
3V3: D11.1 J3.H1(H+) J3.H2(H) J3.V1(V+) R3.1 R9.1 R11.1 R14.1 R16.1 R17.1 R20.1 R21.1 R24.1 R25.1
GND: C11.1 C12.1 C15.1 C16.1 C17.1 C18.1 C19.1 C20.1 C21.1 C22.1 C23.1 D8.2 D9.2 D10.2 D11.2 D12.2 D13.2 D14.2 D15.2 D16.2 D17.2 D18.2 J3.B2A(SEL-) J3.H3(H-) J3.V3(V-) S2.1 S3.1 S4.1 S5.1 S6.1 S7.1 S8.1 S9.1
NetC11_2: C11.2 R12.2 ; port nPB_1
NetC12_2: C12.2 R13.2 ; port nPB_5
NetC15_2: C15.2 R10.2 ; port nJOY_BTN
NetC16_2: C16.2 R14.2 ; port JOY_X
NetC17_2: C17.2 R15.2 ; port JOY_Y
NetC18_2: C18.2 R18.2 ; port nPB_2
NetC19_2: C19.2 R19.2 ; port nPB_6
NetC20_2: C20.2 R22.2 ; port nPB_3
NetC21_2: C21.2 R23.2 ; port nPB_7
NetC22_2: C22.2 R26.2 ; port nPB_4
NetC23_2: C23.2 R27.2 ; port nPB_8
NetD8_1: D8.1 R9.2 R12.1 S2.3
NetD9_1: D9.1 R11.2 R13.1 S3.3
NetD10_1: D10.1 J3.V2(V) R15.1
NetD12_1: D12.1 J3.B1A(SEL+) R3.2 R10.1
NetD13_1: D13.1 R16.2 R18.1 S4.3
NetD14_1: D14.1 R17.2 R19.1 S5.3
NetD15_1: D15.1 R20.2 R22.1 S6.3
NetD16_1: D16.1 R21.2 R23.1 S7.3
NetD17_1: D17.1 R24.2 R26.1 S8.3
NetD18_1: D18.1 R25.2 R27.1 S9.3

Not connected (* = marked no-connect by the designer): J3 S1(SHIELD)* S2(SHIELD)* S3(SHIELD)* S4(SHIELD)*; S2 2* 4*; S3 2* 4*; S4 2* 4*; S5 2* 4*; S6 2* 4*; S7 2* 4*; S8 2* 4*; S9 2* 4*

### Notes on the sheet
- 2-Axis Joystick
- Pushbuttons
- For Debounce Circuits:
  T=RC -> C= T/R
  C= 10ms/10kOhms= 1uF
- Controls
  Joystick:
  - Up/Down is for elevator, Left/Right is for opening/closing shovel
  - Button should be used to choose between L/R and U/D, since the science mechanism may be damaged if too many things are moving at once
  Buttons:
  - 1/2: Move left/right 1 index
  - 3/4: Move to leftmost/rightmost index
  - 5/6: Open/close lid
  - 7: Pre-programmed mixing sequence
  - 8: Extra, in case additional functionality is requested later
- Title
- Size:
- Date:
- Letter
- Drawn By:
- Sheet
- of
- File:

### Library data of the parts
C11 C12 C15-C23 = CAP_1uF_16V_0805: as C10 on sheet SH2-MCU; Mount: Surface Mount; Case Code (Metric): 2012; Case Code (Imperial): 0805; Min Operating Temperature: -55°C; Max Operating Temperature: 125°C; Dielectric: X7R; Termination: SMD/SMT; Supplier 1: Digi-Key; Supplier Part Number 1: 311-1365-1-ND; Package: 0805 (2012 Metric)
D8-D18 = TVS_DIODE_UNIDIR_3.3V: as D5 on sheet SH1-POWER; Supplier 1: Digi-Key; Mount: Surface Mount; Number of Pins: 2; Min Operating Temperature: -55°C; Max Operating Temperature: 150°C; Reverse Standoff Voltage: 3.3V; Clamping Voltage: 14.1V; Composition: Zener; Supplier Part Number 1: ESD5Z3.3T1GOSCT-ND
J3 = 2_AXIS_JOYSTICK: JOYSTICK 10K OHM 2 AXIS TH; Manufacturer 1: SparkFun; Supplier 1: Digi-Key; Stock 1: 1039; Pricing 1: 1=3.95000 (USD); RoHS: No; ComponentLink1URL: https://media.digikey.com/pdf/Data%20Sheets/Sparkfun%20PDFs/COM-09032_Web.pdf?src-supplier=Digi-Key; ComponentLink1Description: https://media.digikey.com/pdf/Data%20Sheets/Sparkfun%20PDFs/COM-09032_Web.pdf?src-supplier=Digi-Key; Supplier Part Number 1: 1568-1526-ND
R3 R9-R27 = RES_10kΩ_0805: as R6 on sheet SH2-MCU; Supplier 1: Digi-Key; Case Code (Metric): 2012; Min Operating Temperature: -55°C; Max Operating Temperature: 155°C; Resistance: 10K; Tolerance: 1%; Termination: SMD/SMT; Supplier Part Number 1: 311-10.0KCRCT-ND; Package: 0805 (2012 Metric)
S2-S9 = MOMENTARY_SWITCH_TH: Momentary Switch (Pushbutton) - SPST; Manufacturer 1: SparkFun; SymbolName_1: SWITCH-MOMENTARY-2; PROD_ID: SWCH-09185; SF_SKU: COM-09190; Package: TACTILE_SWITCH_PTH_12MM; Supplier 1: Digi-Key; Stock 1: 32; Pricing 1: 1=5.85000 (USD); RoHS: No; Mount: Through Hole; Throw Configuration: SPST; Termination: PC Pin; ComponentLink1URL: https://www.sparkfun.com/datasheets/Components/Buttons/TSA12110%20TACT%20SWITCH.jpg?src-supplier=Digi-Key; ComponentLink1Description: https://www.sparkfun.com/datasheets/Components/Buttons/TSA12110%20TACT%20SWITCH.jpg?src-supplier=Digi-Key; Supplier Part Number 1: 1568-1332-ND

## Nets that join several sheets
3V3: SH1-POWER (C26.2 R1.2 TP2.1 U1.2), SH2-MCU (17 pins), SH3-CONTROLS (14 pins)
GND: SH1-POWER (12 pins), SH2-MCU (21 pins), SH3-CONTROLS (33 pins)
NetC11_2: SH2-MCU (U2.26), SH3-CONTROLS (C11.2 R12.2)
NetC12_2: SH2-MCU (U2.33), SH3-CONTROLS (C12.2 R13.2)
NetC15_2: SH2-MCU (U2.14), SH3-CONTROLS (C15.2 R10.2)
NetC16_2: SH2-MCU (U2.15), SH3-CONTROLS (C16.2 R14.2)
NetC17_2: SH2-MCU (U2.16), SH3-CONTROLS (C17.2 R15.2)
NetC18_2: SH2-MCU (U2.27), SH3-CONTROLS (C18.2 R18.2)
NetC19_2: SH2-MCU (U2.34), SH3-CONTROLS (C19.2 R19.2)
NetC20_2: SH2-MCU (U2.28), SH3-CONTROLS (C20.2 R22.2)
NetC21_2: SH2-MCU (U2.35), SH3-CONTROLS (C21.2 R23.2)
NetC22_2: SH2-MCU (U2.29), SH3-CONTROLS (C22.2 R26.2)
NetC23_2: SH2-MCU (U2.36), SH3-CONTROLS (C23.2 R27.2)
NetD5_1: SH1-POWER (D5.1 J1.2), SH2-MCU (U2.58)
NetD6_1: SH1-POWER (D6.1 J1.3), SH2-MCU (U2.59)